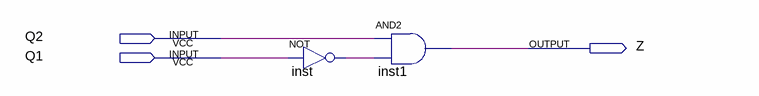
[diagram p0: schematic sheet]
// Quartus schematic Z.bdf as structural Verilog: 2 symbols, 3 pins
module Z (
  input  Q2,
  input  Q1,
  output Z
);

  wire inst_out;

  not inst (inst_out, Q1);
  and inst1 (Z, Q2, inst_out);
endmodule
